# Altium schematic sheet 10_CAN_Interface.SchDoc
size A4
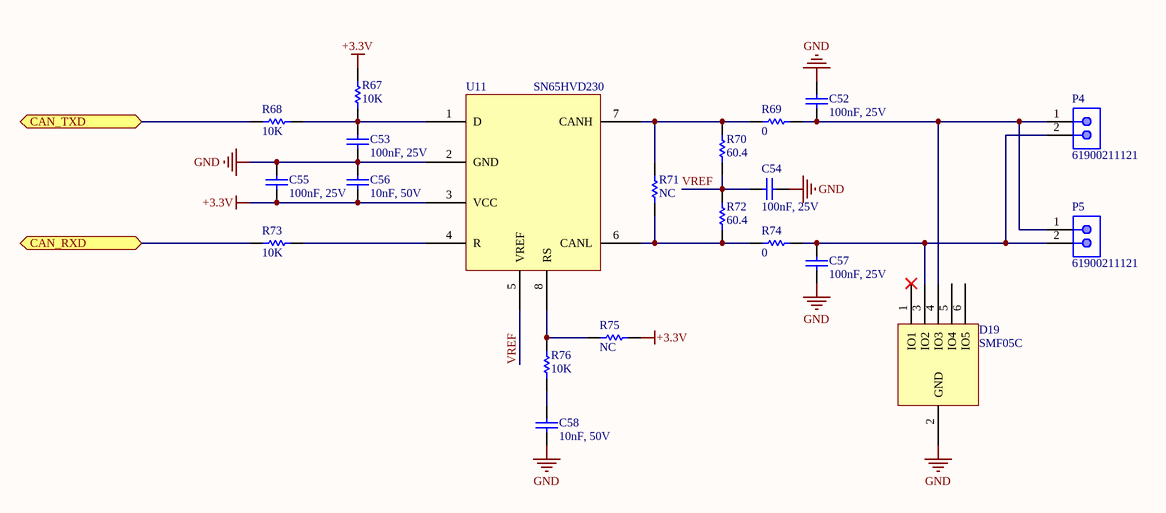
[diagram p0: 10_CAN_Interface.SchDoc]

## Parts
C52  100nF, 25V  [WCAP-CSGP_0603_H=0.8mm_Reflow]
C53  100nF, 25V  [WCAP-CSGP_0603_H=0.8mm_Reflow]
C54  100nF, 25V  [WCAP-CSGP_0603_H=0.8mm_Reflow]
C55  100nF, 25V  [WCAP-CSGP_0603_H=0.8mm_Reflow]
C56  10nF, 50V  [WCAP-CSGP_0603_H=0.8mm_Reflow]
C57  100nF, 25V  [WCAP-CSGP_0603_H=0.8mm_Reflow]
C58  10nF, 50V  [WCAP-CSGP_0603_H=0.8mm_Reflow]
D19  SMF05C  [SOT65P210X110-6N]
P4  61900211121  [61900211121]
P5  61900211121  [61900211121]
R67  value 10K  [RES-SM-0603]  (hidden comment: RESISTOR SMD)
R68  value 10K  [RES-SM-0603]  (hidden comment: RESISTOR SMD)
R69  value 0  [RES-SM-0603]  (hidden comment: RESISTOR SMD)
R70  value 60.4  [RES-SM-0603]  (hidden comment: RESISTOR SMD)
R71  value NC  [RES-SM-0603]  (hidden comment: RESISTOR SMD)
R72  value 60.4  [RES-SM-0603]  (hidden comment: RESISTOR SMD)
R73  value 10K  [RES-SM-0603]  (hidden comment: RESISTOR SMD)
R74  value 0  [RES-SM-0603]  (hidden comment: RESISTOR SMD)
R75  value NC  [RES-SM-0603]  (hidden comment: RESISTOR SMD)
R76  value 10K  [RES-SM-0603]  (hidden comment: RESISTOR SMD)
U11  SN65HVD230  [SOIC127P600X175-8N]

## Ports
CAN_RXD (bidir), CAN_TXD (bidir)

## Nets
+3.3V: C55.1 C56.1 R67.2 R75.1 U11.3(VCC)
GND: C52.2 C53.1 C54.1 C55.2 C56.2 C57.1 C58.1 D19.2(GND) U11.2(GND)
CAN_RXD: R73.2 ; port CAN_RXD
CAN_TXD: R68.2 ; port CAN_TXD
VREF: C54.2 R70.2 R72.1 U11.5(VREF)
NetC52_1: C52.1 D19.4(IO3) P4.1 P5.1 R69.1
NetC53_2: C53.2 R67.1 R68.1 U11.1(D)
NetC57_2: C57.2 D19.3(IO2) P4.2 P5.2 R74.1
NetC58_2: C58.2 R76.1
NetR69_2: R69.2 R70.1 R71.1 U11.7(CANH)
NetR71_2: R71.2 R72.2 R74.2 U11.6(CANL)
NetR73_1: R73.1 U11.4(R)
NetR75_2: R75.2 R76.2 U11.8(RS)

Not connected (* = marked no-connect by the designer): D19 1(IO1)* 5(IO4) 6(IO5)

## Library data of the parts
C52-C55 C57 = 885012206071: WCAP-CSGP Multilayer Ceramic Chip Capacitor, General Purpose, size 0603, X7R, 100nF, 25V; Manufacturer: Wurth Elektronik; Rated Voltage: 25VDC; Isolation Resistance: >=5GOhm; Capacitance Tolerance: +/-10%; Technical Reference: X7R0603104K025DFCT10000; ComponentLink1Description: Manufacturer; ComponentLink1URL: http://www.we-online.de; ComponentLink2Description: Datasheet; ComponentLink2URL: https://www.we-online.com/catalog/datasheet/885012206071.pdf; Operating Temperature: -55 to +125degC; Packaging: Tape and Reel; Manufacturer Part Number: 885012206071; Published Date: May 2020; Ceramic Type: X7R; Dissipation Factor: =<3.5%; Height: 0.8mm; Mounting Technology: SMT; Size: 0603; Capacitance: 100nF
C56 C58 = 885012206089: WCAP-CSGP Multilayer Ceramic Chip Capacitor, General Purpose, size 0603, X7R, 10nF, 50V; Manufacturer: Wurth Elektronik; Rated Voltage: 50VDC; Isolation Resistance: >=10GOhm; Capacitance Tolerance: +/-10%; Technical Reference: X7R0603103K050DFCT10000; ComponentLink1Description: Manufacturer; ComponentLink1URL: http://www.we-online.de; ComponentLink2Description: Datasheet; ComponentLink2URL: https://www.we-online.com/catalog/datasheet/885012206089.pdf; Operating Temperature: -55 to +125degC; Packaging: Tape and Reel; Manufacturer Part Number: 885012206089; Published Date: May 2020; Ceramic Type: X7R; Dissipation Factor: =<2.5%; Height: 0.8mm; Mounting Technology: SMT; Size: 0603; Capacitance: 10nF
P4 P5 = 61900211121: WR-WTB THT Male Vertical Locking Header, pitch 2.54mm, 2p; Pin Number: 2; Contact Resistance: 20mOhm; Rated Current: 3A; Withstanding Voltage: 1000VAC; Working Voltage: 250VAC; ComponentLink1Description: Manufacturer; ComponentLink1URL: http://www.we-online.de; ComponentLink2Description: Datasheet; ComponentLink2URL: https://www.we-online.com/catalog/datasheet/61900211121.pdf; Pitch: 2.54mm; Published Date: January 2020; Publisher: Wurth Elektronik; Mounting Technology: THT; Packaging: Bag; Operating Temperature: -40 to +105degC; Part Number: 61900211121; Gender: Male; Type: Vertical
R67-R76 = RESISTOR SMD: Resistor